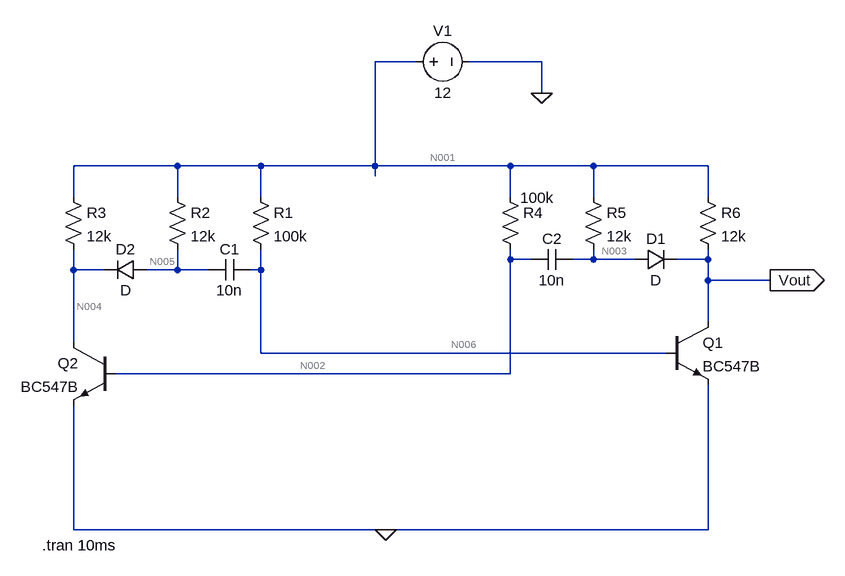
[diagram p0: schematic am3.asc]
am3.asc, the LTspice schematic file:
Version 4
SHEET 1 976 680
WIRE 320 -144 256 -144
WIRE 512 -144 400 -144
WIRE 512 -96 512 -144
WIRE -48 16 -208 16
WIRE 80 16 -48 16
WIRE 256 16 256 -144
WIRE 256 16 80 16
WIRE 464 16 256 16
WIRE 592 16 464 16
WIRE 768 16 592 16
WIRE 256 32 256 16
WIRE -208 64 -208 16
WIRE -48 64 -48 16
WIRE 80 64 80 16
WIRE 464 64 464 16
WIRE 592 64 592 16
WIRE 768 64 768 16
WIRE 464 160 464 144
WIRE 496 160 464 160
WIRE 592 160 592 144
WIRE 592 160 560 160
WIRE 656 160 592 160
WIRE 768 160 768 144
WIRE 768 160 720 160
WIRE -208 176 -208 144
WIRE -160 176 -208 176
WIRE -48 176 -48 144
WIRE -48 176 -96 176
WIRE 0 176 -48 176
WIRE 80 176 80 144
WIRE 80 176 64 176
WIRE 768 192 768 160
WIRE 864 192 768 192
WIRE 768 256 768 192
WIRE -208 288 -208 176
WIRE 80 304 80 176
WIRE 704 304 80 304
WIRE 464 336 464 160
WIRE 464 336 -144 336
WIRE -208 576 -208 384
WIRE 272 576 -208 576
WIRE 768 576 768 352
WIRE 768 576 272 576
FLAG 272 576 0
FLAG 512 -96 0
FLAG 864 192 Vout
IOPIN 864 192 Out
SYMBOL res 64 48 R0
SYMATTR InstName R1
SYMATTR Value 100k
SYMBOL res -64 48 R0
SYMATTR InstName R2
SYMATTR Value 12k
SYMBOL res -224 48 R0
SYMATTR InstName R3
SYMATTR Value 12k
SYMBOL res 448 48 R0
WINDOW 3 31 17 Left 2
SYMATTR Value 100k
SYMATTR InstName R4
SYMBOL res 576 48 R0
SYMATTR InstName R5
SYMATTR Value 12k
SYMBOL res 752 48 R0
SYMATTR InstName R6
SYMATTR Value 12k
SYMBOL cap 64 160 R90
WINDOW 0 0 32 VBottom 2
WINDOW 3 32 32 VTop 2
SYMATTR InstName C1
SYMATTR Value 10n
SYMBOL cap 560 144 R90
WINDOW 0 0 32 VBottom 2
WINDOW 3 32 32 VTop 2
SYMATTR InstName C2
SYMATTR Value 10n
SYMBOL diode 656 176 R270
WINDOW 0 32 32 VTop 2
WINDOW 3 0 32 VBottom 2
SYMATTR InstName D1
SYMBOL diode -96 160 R90
WINDOW 0 0 32 VBottom 2
WINDOW 3 32 32 VTop 2
SYMATTR InstName D2
SYMBOL npn 704 256 R0
SYMATTR InstName Q1
SYMATTR Value BC547B
SYMBOL npn -144 288 M0
SYMATTR InstName Q2
SYMATTR Value BC547B
SYMBOL voltage 304 -144 R270
WINDOW 0 32 56 VTop 2
WINDOW 3 -32 56 VBottom 2
WINDOW 123 0 0 Left 0
WINDOW 39 0 0 Left 0
SYMATTR InstName V1
SYMATTR Value 12
TEXT -256 600 Left 2 !.tran 10ms

The netlist it stands for:
* am3.asc
R1 N001 N006 100k
R2 N001 N005 12k
R3 N001 N004 12k
R4 N001 N002 100k
R5 N001 N003 12k
R6 N001 Vout 12k
C1 N006 N005 10n
C2 N003 N002 10n
D1 N003 Vout D
D2 N005 N004 D
Q1 Vout N006 0 0 BC547B
Q2 N004 N002 0 0 BC547B
V1 N001 0 12
.model D D
.lib standard.dio
.model NPN NPN
.model PNP PNP
.lib standard.bjt
.tran 10ms
.backanno
.end

* Results of the author's LTspice run, read from the files saved beside the schematic
* Operating Point, zero values left out:
*   V(n001) = 12 V
*   V(n006) = 666.1 mV
*   V(n005) = 696 mV
*   V(n004) = 42.38 mV
*   V(n002) = 666.1 mV
*   V(n003) = 696 mV
*   V(vout) = 42.38 mV
*   Ic(Q2) = 1.938 mA
*   Ib(Q2) = 113.3 µA
*   Ie(Q2) = -2.052 mA
*   Ic(Q1) = 1.938 mA
*   Ib(Q1) = 113.3 µA
*   Ie(Q1) = -2.052 mA
*   I(D2) = 942 µA
*   I(D1) = 942 µA
*   I(R6) = 996.5 µA
*   I(R5) = 942 µA
*   I(R4) = 113.3 µA
*   I(R3) = 996.5 µA
*   I(R2) = 942 µA
*   I(R1) = 113.3 µA
*   I(V1) = -4.104 mA
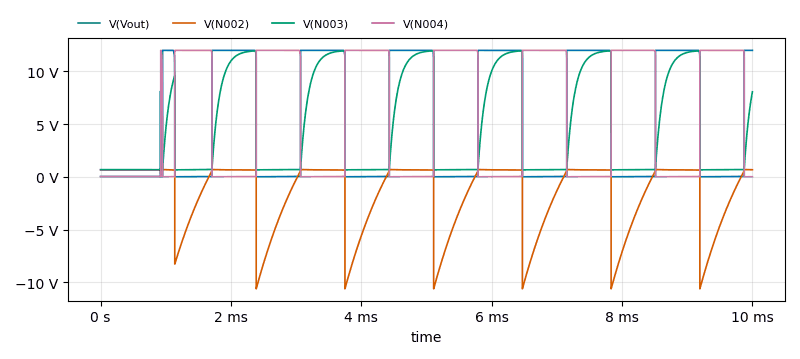
[diagram p1: Transient Analysis of am3.asc, plotted from the saved traces]
* Transient Analysis, 1 run:
*   V(Vout): min 16.58 mV, max 12 V, average 5.29 V, rms 7.95 V, last 12 V
*   V(N002): min -10.6 V, max 702.9 mV, average -1.626 V, rms 3.654 V, last 684.8 mV
*   V(N003): min 673.2 mV, max 11.96 V, average 4.662 V, rms 6.743 V, last 8.073 V
*   V(N004): min 16.56 mV, max 12 V, average 5.633 V, rms 8.205 V, last 23.41 mV